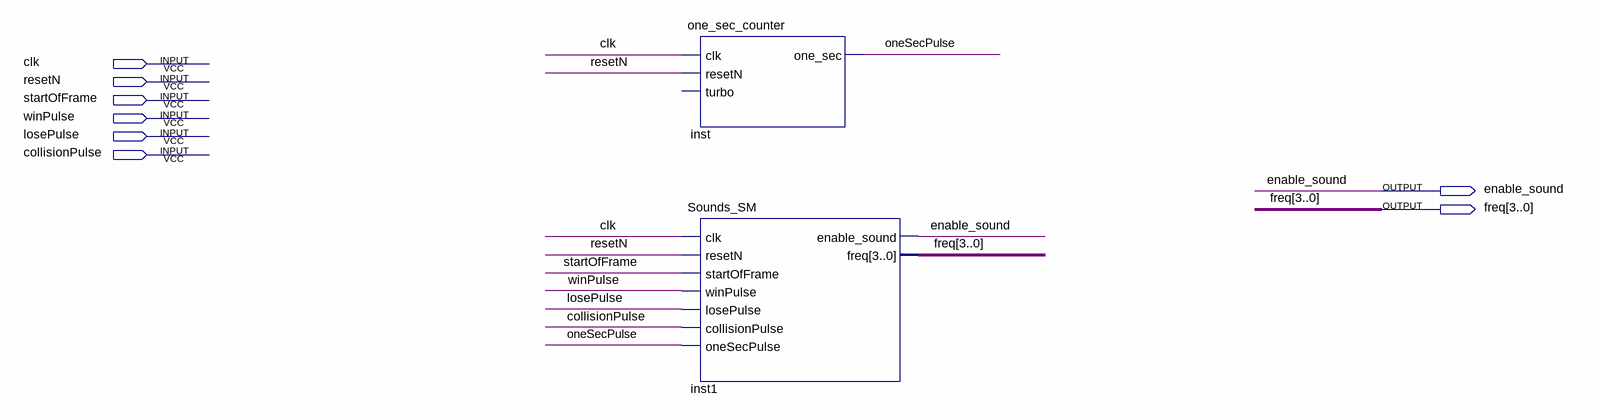
[diagram p0: schematic sheet]
// Quartus schematic SoundBlock.bdf as structural Verilog: 2 symbols, 8 pins
module SoundBlock (
  input  clk,
  input  resetN,
  input  startOfFrame,
  input  winPulse,
  input  losePulse,
  input  collisionPulse,
  output enable_sound,
  output [3:0] freq
);

  wire oneSecPulse;

  one_sec_counter inst (.clk(clk), .resetN(resetN), .one_sec(oneSecPulse));  // open: turbo
  Sounds_SM inst1 (
    .clk(clk), .resetN(resetN), .startOfFrame(startOfFrame), .winPulse(winPulse), .losePulse(losePulse),
    .collisionPulse(collisionPulse), .oneSecPulse(oneSecPulse), .enable_sound(enable_sound), .freq(freq));
endmodule
